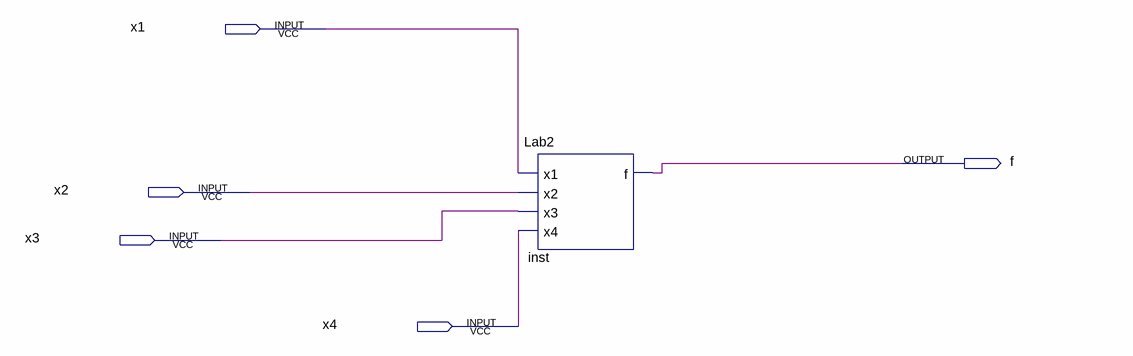
[diagram p0: schematic sheet]
// Quartus schematic Block2.bdf as structural Verilog: 1 symbols, 5 pins
module Block2 (
  input  x1,
  input  x2,
  input  x3,
  input  x4,
  output f
);

  Lab2 inst (.x1(x1), .x2(x2), .x3(x3), .x4(x4), .f(f));
endmodule
